# EAGLE design power (EAGLE 7.2.0)
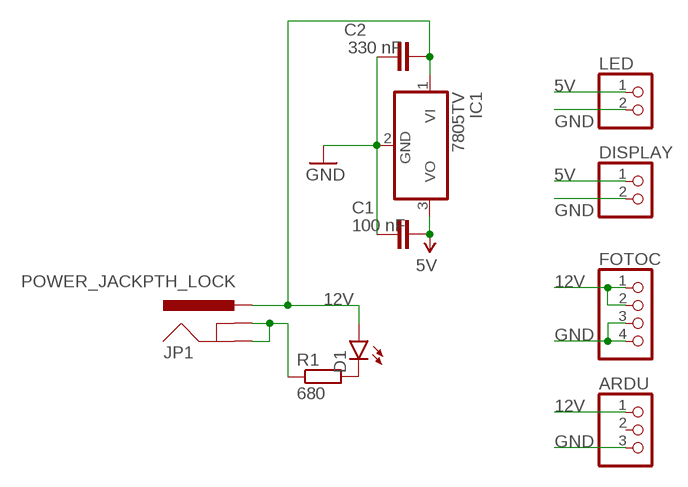
[diagram p0: schematic, sheet 1]

## Parts
ARDU  PINHD-1X3  [1X03]
C1  100 nF  C-EU025-025X050  [C025-025X050]
C2  330 nF  C-EU025-025X050  [C025-025X050]
D1  LED5MM  [LED5MM]
DISPLAY  PINHD-1X2  [1X02]
FOTOC  PINHD-1X4  [1X04]
IC1  7805TV  [TO220V]
JP1  POWER_JACKPTH_LOCK  [POWER_JACK_PTH_LOCK]
LED  PINHD-1X2  [1X02]
R1  680  R-EU_0207/10  [0207/10]

## Nets
5V: C1.1 DISPLAY.1 IC1.3(VO) LED.1
12V: ARDU.1 C2.2 D1.A FOTOC.1 FOTOC.2 IC1.1(VI) JP1.PWR
GND: ARDU.3 C1.2 C2.1 DISPLAY.2 FOTOC.3 FOTOC.4 IC1.2(GND) JP1.GND JP1.GNDBREAK LED.2 R1.1
N$10: D1.K(C) R1.2
Unconnected: ARDU.2

## Library data of the parts
ARDU = pinhead:PINHD-1X3: PIN HEADER
C1 C2 = resistor:C-EU: CAPACITOR, European symbol
D1 = SparkFun-LED:LED: LEDs Standard schematic elements and footprints for 5mm, 3mm, 1206, and 0603 sized LEDs. 5mm - Spark Fun Electronics SKU : COM-00529 (and others)
DISPLAY LED = pinhead:PINHD-1X2: PIN HEADER
FOTOC = pinhead:PINHD-1X4: PIN HEADER
IC1 = linear:78*: Positive VOLTAGE REGULATOR Source: http://cache.national.com/ds/LM/LM78L05.pdf http://www.fairchildsemi.com/ds/LM/LM7805.pdf
JP1 = SparkFun-Connectors:POWER_JACK: Power Jack This is the standard 5.5mm barrel jack for power. The PTH is the most common, proven, reliable, footprint. The Slot footprint only works if the mill layer is transmitted to the PCB fab house so be warned. Mating wall wart : TOL-00298 (and others); PROD_ID: CONN-08197; SF_ID: PRT-00119
R1 = resistor:R-EU_: RESISTOR, European symbol

## Board
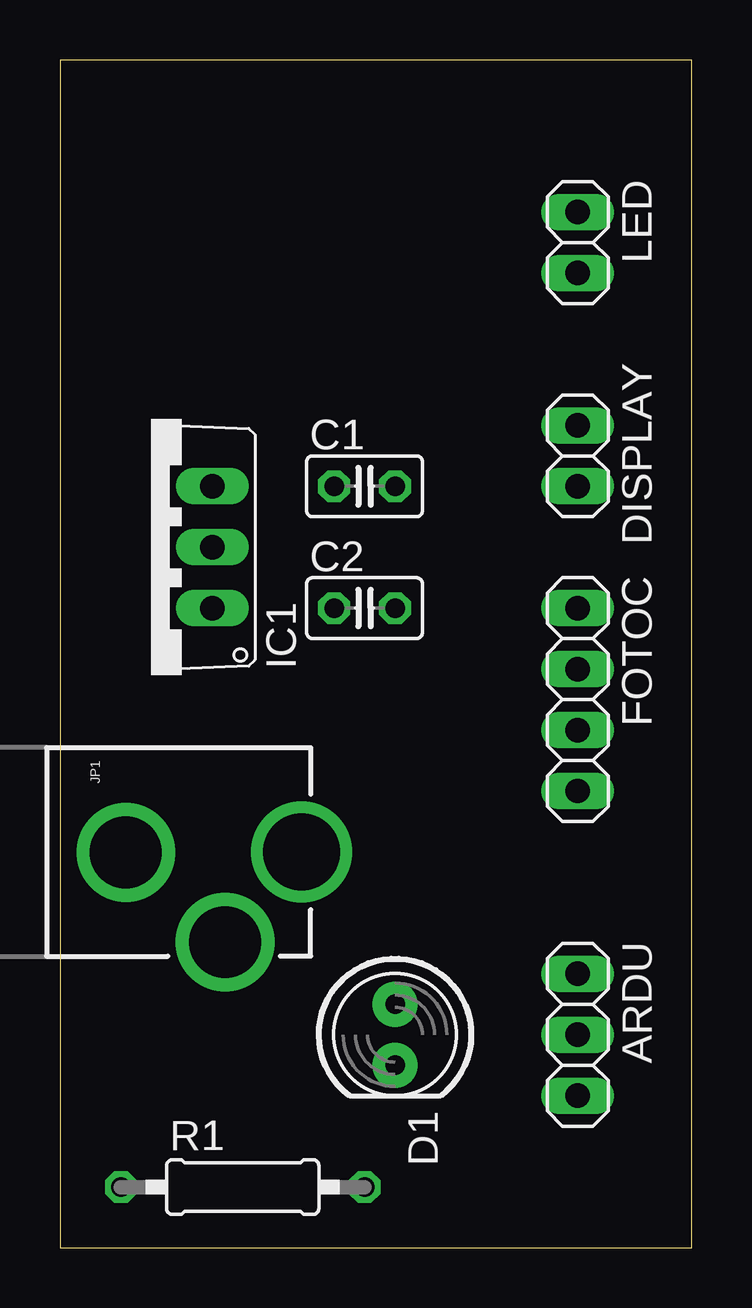
[diagram p1: board, top side]
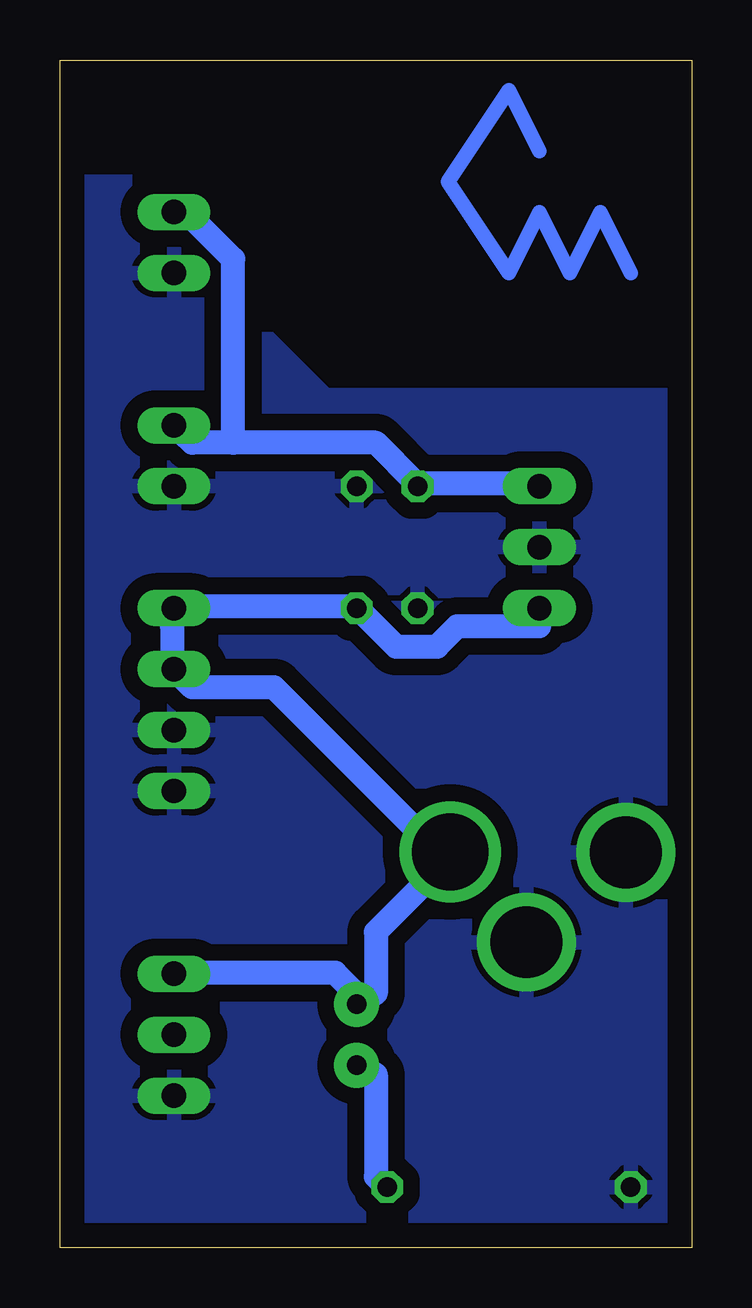
[diagram p2: board, bottom side, seen from below]

Size 26.34 x 49.52 mm. Coordinates in mm from the lower left corner, seen from the top.
Outline: 0,0 26.34,0 26.34,49.52 0,49.52 0,0
Copper layers (1*16): Top 0.035mm / dielectric 1.5mm / Bottom 0.035mm
Design rules "default *": minimum track width 1mm, minimum drill 1mm, track to track 0.7mm, track to pad 8mil, pad to pad 8mil, via to via 8mil, smd to smd 8mil, copper to edge 40mil, drill to drill 8mil, minimum pad ring 10mil, minimum via ring 8mil, stop-mask expansion 4mil, vias tented up to drill 0mil, thermal gap 10mil

### Footprints (pad centres in the part's own frame; a part is rotated, then mirrored left to right if it is on the bottom)
1X03 = drill 1.016 long: 1 -2.54,0; 2 0,0; 3 2.54,0
C025-025X050 = drill 0.813 octagon: 1 -1.27,0; 2 1.27,0
LED5MM = drill 0.813 pad 1.88: A -1.27,0; K 1.27,0
1X02 = drill 1.016 long: 1 -1.27,0; 2 1.27,0
1X04 = drill 1.016 long: 1 -3.81,0; 2 -1.27,0; 3 1.27,0; 4 3.81,0
TO220V = drill 1.016 long: 1 -2.54,-2.54; 2 0,-2.54; 3 2.54,-2.54
POWER_JACK_PTH_LOCK = drill 2.997 pad 4.115: GND 0.025,6.557; GNDBREAK 3.762,10.7 | drill 3.2 pad 4.115: PWR 0,13.878
0207/10 = drill 0.813 octagon: 1 -5.08,0; 2 5.08,0

### Placement (x,y rotation side)
ARDU  21.59,8.89 270 top
C1  12.7,31.75 0 top
C2  12.7,26.67 0 top
D1  13.97,8.89 270 top
DISPLAY  21.59,33.02 270 top
FOTOC  21.59,22.86 270 top
IC1  3.81,29.21 90 top
JP1  -3.81,16.51 270 top
LED  21.59,41.91 270 top
R1  7.62,2.54 0 top

### Tracks (layer width: path | path; a pad name or v marks a point on that pad's centre or on a via)
5V
  Bottom 1: 11.47,31.87 6.37,31.87 IC1.3 | 19.12,33.57 13.17,33.57 11.47,31.87 | 19.12,33.57 20.82,33.57 DISPLAY.1 | 11.47,31.87 C1.1 | 19.12,33.57 19.12,41.22 20.82,42.92 LED.1
12V
  Bottom 1: 14.02,26.77 20.82,26.77 FOTOC.1 21.67,25.92 21.67,24.22 FOTOC.2 20.82,23.37 17.42,23.37 10.62,16.57 JP1.PWR 10.62,15.72 13.17,13.17 13.17,10.62 D1.A 14.02,10.62 14.87,11.47 20.82,11.47 ARDU.1 | 14.02,26.77 12.32,25.07 10.62,25.07 9.77,25.92 6.37,25.92 IC1.1 | 14.02,26.77 C2.2
GND
  pour Bottom (isolate 0.406): 0,35.56 13.97,35.56 15.24,35.56 19.05,39.37 19.05,44.45 25.4,44.45 25.4,0 0,0
N$3
  Bottom 0.61: 2.54,40.64 3.81,43.18 5.08,40.64 6.35,43.18 7.62,40.64 10.16,44.45 7.62,48.26 6.35,45.72
N$10
  Bottom 1: R1.2 13.17,2.97 13.17,7.22 D1.K